# Altium schematic sheet PIC_BSL.SchDoc: Bootstrap and reset detector
size A4; SheetNumber: 9; SheetTotal: 10; Project: WSN Z1; Comments: Pic with comm
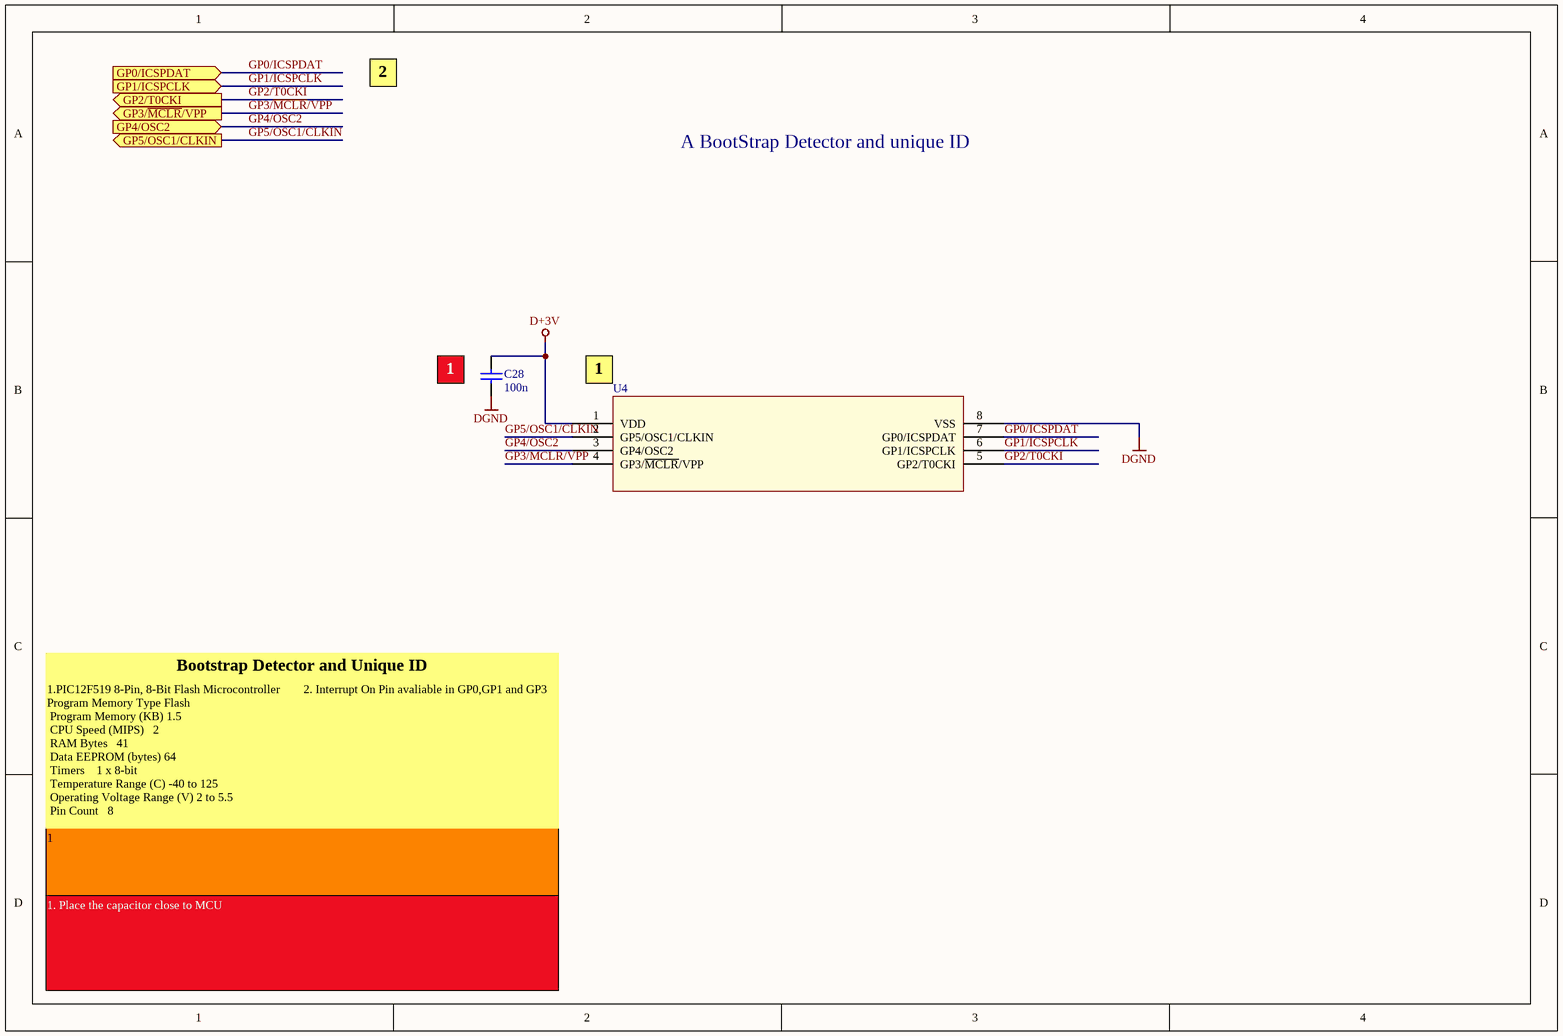
[diagram p0: PIC_BSL.SchDoc]

## Parts
C28  value 100n  [CC1005-0402]  (hidden comment: Cap Semi)
U4  8-Bit CMOS Microcontroller  [DFN 2x3x0.9mm]  (value not drawn)

## Ports
GP0/ICSPDAT (in), GP1/ICSPCLK (in), GP2/T0CKI (out), GP3/~{MCLR}/VPP (out), GP4/OSC2 (in), GP5/OSC1/CLKIN (out)

## Nets
D+3V: C28.2 U4.1(VDD)
DGND: C28.1 U4.8(VSS)
GP0/ICSPDAT: U4.7(GP0/ICSPDAT) ; port GP0/ICSPDAT
GP1/ICSPCLK: U4.6(GP1/ICSPCLK) ; port GP1/ICSPCLK
GP2/T0CKI: U4.5(GP2/T0CKI) ; port GP2/T0CKI
GP3/~{MCLR}/VPP: U4.4(GP3/~{MCLR}/VPP) ; port GP3/~{MCLR}/VPP
GP4/OSC2: U4.3(GP4/OSC2) ; port GP4/OSC2
GP5/OSC1/CLKIN: U4.2(GP5/OSC1/CLKIN) ; port GP5/OSC1/CLKIN

## Notes on the sheet
- 2
- A BootStrap Detector and unique ID
- (near C28) 1
- (near U4) 1
- Bootstrap Detector and Unique ID
- 1.PIC12F519 8-Pin, 8-Bit Flash Microcontroller
  Program Memory Type	Flash
  Program Memory (KB)	1.5
  CPU Speed (MIPS)	 	2
  RAM Bytes	 	41
  Data EEPROM (bytes)	64
  Timers	 		1 x 8-bit
  Temperature Range (C)	-40 to 125
  Operating Voltage Range (V)	2 to 5.5
  Pin Count			8
- 2. Interrupt On Pin avaliable in GP0,GP1 and GP3
- 1
- 1. Place the capacitor close to MCU

## Library data of the parts
C28 = Cap Semi: Capacitor (Semiconductor SIM Model)
U4 = PIC12F589: 8-Bit CMOS Microcontroller, Program Memory (KB)  1.5,  RAM Bytes  41, Data EEPROM (bytes)  64,  Pin Count  8